# EAGLE design KEYDUINO nano (EAGLE 7.4.0)
5V: 2
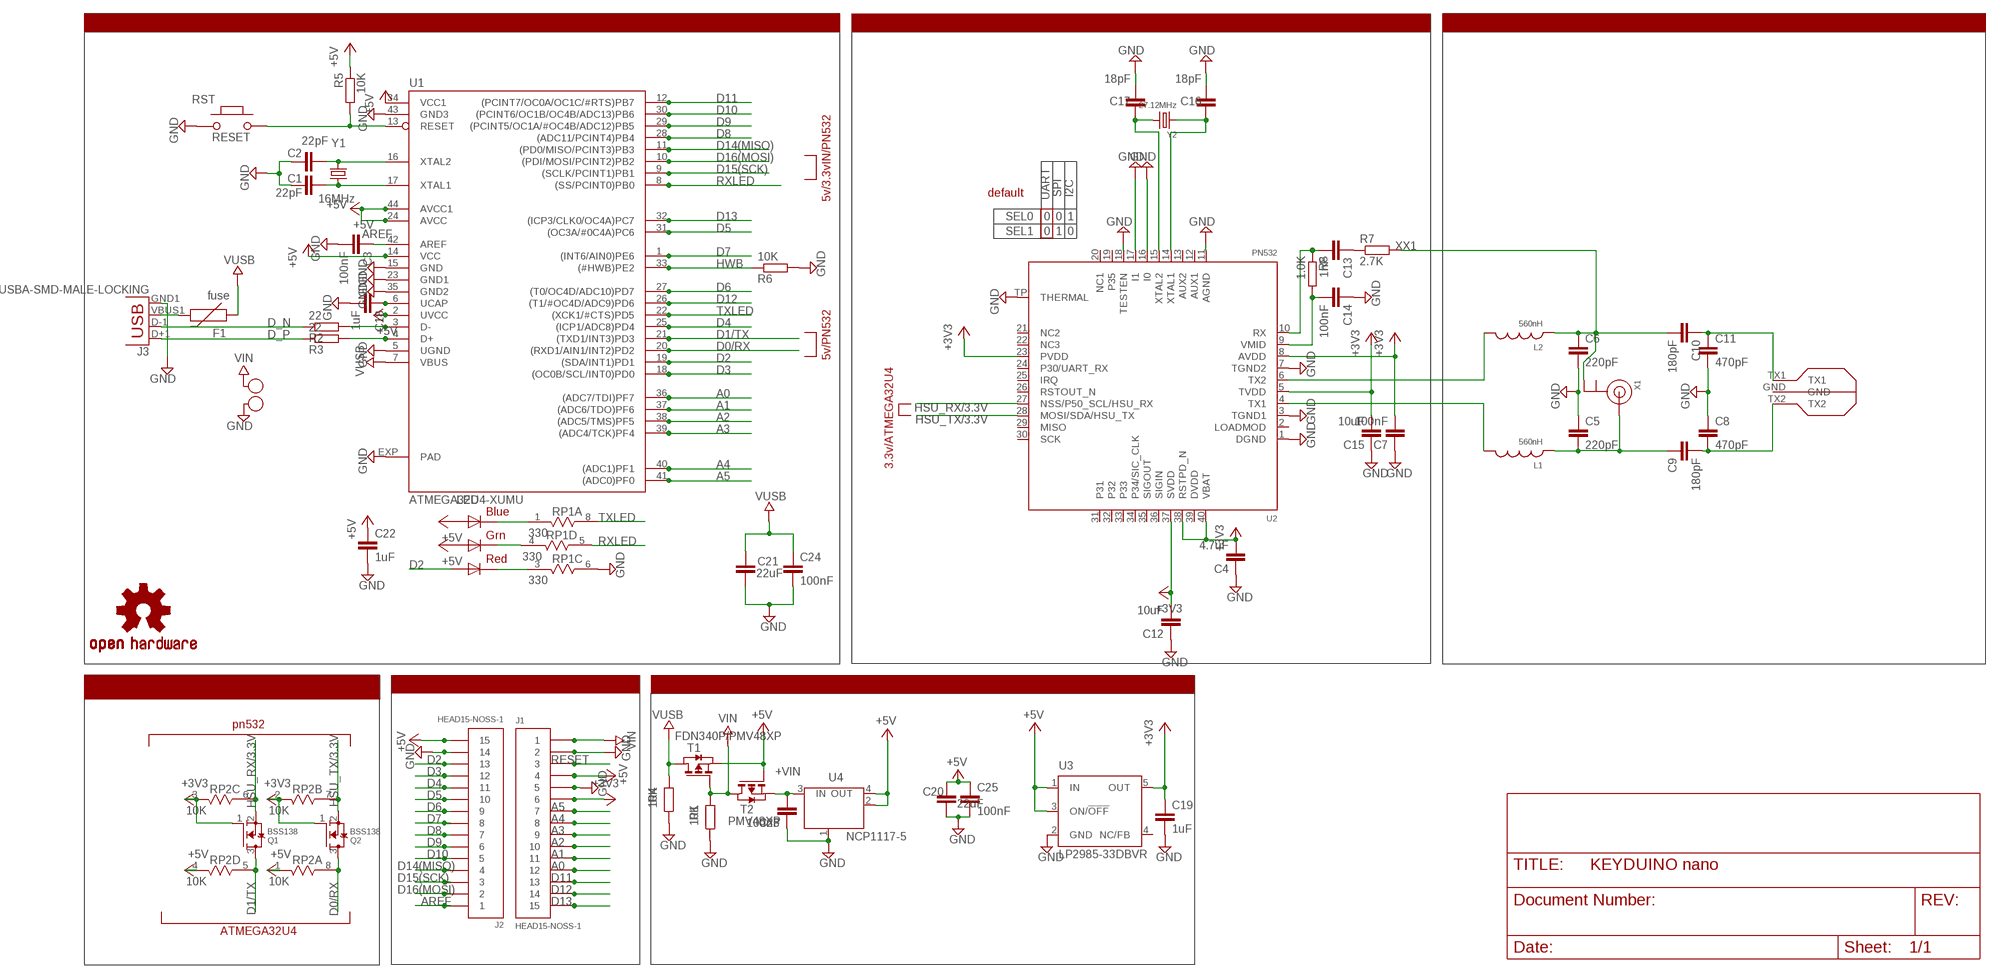
[diagram p0: schematic, sheet 1]

## Parts
C1  22pF  CAP0603-CAP  [0603-CAP]
C2  22pF  CAP0603-CAP  [0603-CAP]
C3  100nF  C-EUC0402  [C0402]
C4  4.7uF  C-EUC0603  [C0603]
C5  220pF  C-EUC0603  [C0603]
C6  220pF  C-EUC0603  [C0603]
C7  100nF  C-EUC0603  [C0603]
C8  470pF  C-EUC0603  [C0603]
C9  180pF  C-EUC0603  [C0603]
C10  180pF  C-EUC0603  [C0603]
C11  470pF  C-EUC0603  [C0603]
C12  10uF  C-EUC0805  [C0805]
C13  1nF  C-EUC0603  [C0603]
C14  100nF  C-EUC0603  [C0603]
C15  10uF  C-EUC0805  [C0805]
C16  18pF  C-EUC0402  [C0402]
C17  18pF  C-EUC0402  [C0402]
C18  1uF  C-EUC0603  [C0603]
C19  1uF  C-EUC0603  [C0603]
C20  22uF  C-EUC0805  [C0805]
C21  22uF  C-EUC0805  [C0805]
C22  1uF  C-EUC0603  [C0603]
C23  100nF  C-EUC0603  [C0603]
C24  100nF  C-EUC0603  [C0603]
C25  100nF  C-EUC0603  [C0603]
F1  fuse  PTC0603  [0603]
H1  SEW_HOLE-SMALL  [SIMPLE_HOLE_SM]
H2  SEW_HOLE-SMALL  [SIMPLE_HOLE_SM]
J1  HEAD15-NOSS-1  [HEAD15-NOSS-1]
J2  HEAD15-NOSS-1  [HEAD15-NOSS-1]
J3  USBA-SMD-MALE-LOCKING  [USB-A-SMT-MALE-LOCKING]
L1  560nH  INDUCTOR0805  [0805@1]
L2  560nH  INDUCTOR0805  [0805@1]
LED  RGBLED5050  [RGBLED5050]
LOGO1  OSHW-LOGOM  [OSHW-LOGO-M]
Q1  BSS138  MOSFET-NREFLOW  [SOT23]
Q2  BSS138  MOSFET-NREFLOW  [SOT23]
R1  10K  R-EU_R0603  [R0603]
R2  22  R-EU_R0603  [R0603]
R3  22  R-EU_R0603  [R0603]
R4  10K  R-EU_R0603  [R0603]
R5  10K  R-EU_R0603  [R0603]
R6  10K  R-EU_R0402  [R0402]
R7  2.7K  R-EU_R0603  [R0603]
R8  1.0K  R-EU_R0603  [R0603]
RP1  330  RES4NT  [RES4NT]
RP2  10K  RES4NT  [RES4NT]
RST  RESET  PB157  [157SW]
T1  FDN340P/PMV48XP  PMOSSOT23  [SOT-23]
T2  PMV48XP  PMOSSOT23  [SOT-23]
U1  ATMEGA32U4-XUMU  [QFN44ML7X7]
U2  PN532  [HVQFN40-6X6]
U3  LP2985-33DBVR  LP2985-XXDBVR33  [SOT23-DBV]
U4  NCP1117-5  LINEAR_MC33269ST  [LINEAR_SOT223]
U$1  KN1  [KEYDUINO_NANO_ANTENNA]
X1  ANTENNA_U.FL  [U.FL]
Y1  16MHz  CRYSTAL5X3  [CRYSTAL-SMD-5X3]
Y2  27.12MHz  CRYSTALTHIN  [CRYSTAL_3.2X2.5]

## Nets
+3V3 [+3v3]: C4.2 C7.2 C12.2 C15.2 C19.1 J1.6 Q1.1(G) Q2.1(G) RP2.2 RP2.3 U2.5(TVDD) U2.8(AVDD) U2.23(PVDD) U2.37(SVDD) U2.38(RSTPD_N) U2.40(VBAT) U3.5(OUT)
+5V [+5V]: C20.1 C22.1 C25.1 J1.4 J2.15 LED.1(GREEN_A) LED.3(BLUE_A) R5.1 RP2.1 RP2.4 T1.2(S) T2.3(G) U1.2(UVCC) U1.14(VCC) U1.24(AVCC) U1.34(VCC1) U1.44(AVCC1) U3.1(IN) U3.3(ON/!OFF) U4.2(OUT) U4.4(OUT)
+VIN [+5V]: C23.1 T2.2(S) U4.3(IN)
A0: J1.12 U1.36((ADC7/TDI)PF7)
A1: J1.11 U1.37((ADC6/TDO)PF6)
A2: J1.10 U1.38((ADC5/TMS)PF5)
A3: J1.9 U1.39((ADC4/TCK)PF4)
A4: J1.8 U1.40((ADC1)PF1)
A5: J1.7 U1.41((ADC0)PF0)
AREF: C3.1 J2.1 U1.42(AREF)
CON1 [RF]: C5.2 C9.1 L1.1 X1.3(SIGNAL)
D0/RX: Q2.3(D) RP2.8 U1.20((RXD1/AIN1/INT2)PD2)
D1/TX: Q1.3(D) RP2.5 U1.21((TXD1/INT3)PD3)
D2: J2.13 LED.2(RED_A) U1.19((SDA/INT1)PD1)
D3: J2.12 U1.18((OC0B/SCL/INT0)PD0)
D4: J2.11 U1.25((ICP1/ADC8)PD4)
D5: J2.10 U1.31((OC3A/#0C4A)PC6)
D6: J2.9 U1.27((T0/OC4D/ADC10)PD7)
D7: J2.8 U1.1((INT6/AIN0)PE6)
D8: J2.7 U1.28((ADC11/PCINT4)PB4)
D9: J2.6 U1.29((PCINT5/OC1A/#OC4B/ADC12)PB5)
D10: J2.5 U1.30((PCINT6/OC1B/OC4B/ADC13)PB6)
D11: J1.13 U1.12((PCINT7/OC0A/OC1C/#RTS)PB7)
D12: J1.14 U1.26((T1/#OC4D/ADC9)PD6)
D13: J1.15 U1.32((ICP3/CLK0/OC4A)PC7)
D14(MISO): J2.4 U1.11((PD0/MISO/PCINT3)PB3)
D15(SCK): J2.3 U1.9((SCLK/PCINT1)PB1)
D16(MOSI): J2.2 U1.10((PDI/MOSI/PCINT2)PB2)
D_N: R2.2 U1.3(D-)
D_P: R3.2 U1.4(D+)
GND [power]: C1.2 C2.2 C3.2 C4.1 C5.1 C6.2 C7.1 C8.1 C11.2 C12.1 C14.1 C15.1 C16.1 C17.1 C18.2 C19.2 C20.2 C21.2 C22.2 C23.2 C24.2 C25.2 H2.P$1 J1.2 J1.5 J2.14 J3.GND1(GND) R1.1 R4.1 R6.2 RP1.6 RST.1 U1.5(UGND) U1.15(GND) U1.23(GND1) U1.35(GND2) U1.43(GND3) U1.EXP(PAD) U2.1(DGND) U2.3(TGND1) U2.7(TGND2) U2.11(AGND) U2.16(I0) U2.17(I1) U2.18(TESTEN) U2.TP(THERMAL) U3.2(GND) U4.1(GND/ADJ)
HSU_RX/3.3V: Q1.2(S) RP2.6 U2.27(NSS/P50_SCL/HSU_RX)
HSU_TX/3.3V: Q2.2(S) RP2.7 U2.28(MOSI/SDA/HSU_TX)
HWB: R6.1 U1.33((#HWB)PE2)
N$1: J3.D-1(D-) R2.1
N$2: C1.1 U1.17(XTAL1) Y1.1
N$4: LED.5(RED_C) RP1.3
N$5: C2.1 U1.16(XTAL2) Y1.3
N$7: J3.D+1(D+) R3.1
N$8: C13.1 R7.1
N$9: L1.2 U2.4(TX1)
N$10: L2.2 U2.6(TX2)
N$11: F1.2 J3.VBUS1(VBUS)
N$12: LED.6(GREEN_C) RP1.4
N$13: LED.4(BLUE_C) RP1.1
N$47: C16.2 U2.14(XTAL1) Y2.1
N$48: C17.2 U2.15(XTAL2) Y2.2
N$49: C14.2 R8.2 U2.9(VMID)
N$50: C13.2 R8.1 U2.10(RX)
RESET: J1.3 R5.2 RST.2 U1.13(RESET)
RXLED: RP1.5 U1.8((SS/PCINT0)PB0)
TX1_ANTENNA [RF]: C8.2 C9.2 U$1.TX2
TX2_ANTENNA [RF]: C10.1 C11.1 U$1.TX1
TXLED: RP1.8 U1.22((XCK1/#CTS)PD5)
UCAP: C18.1 U1.6(UCAP)
VIN [+5V]: H1.P$1 J1.1 R1.2 T1.3(G) T2.1(D)
VUSB [+5V]: C21.1 C24.1 F1.1 R4.2 T1.1(D) U1.7(VBUS)
XX1 [RF]: C6.1 C10.2 L2.1 R7.2 X1.2(GND)
Unconnected: RP1.2 RP1.7 U2.2(LOADMOD) U2.12(AUX1) U2.13(AUX2) U2.19(P35) U2.20(NC1) U2.21(NC2) U2.22(NC3) U2.24(P30/UART_RX) U2.25(IRQ) U2.26(RSTOUT_N) U2.29(MISO) U2.30(SCK) U2.31 U2.32 U2.33 U2.34(P34/SIC_CLK) U2.35(SIGOUT) U2.36(SIGIN) U2.39(DVDD) U3.4(NC/FB) U$1.GND U$1.P$4(NT1) U$1.P$5(NT2) X1.1(GND)

## Notes on the sheet
- ATMEGA32U4 | PN532 | ACCORDING CIRCUIT
- 5v/3.3vIN/PN532
- default | UART | SPI | I2C
- SEL0 | 0 | 0 | 1
- SEL1 | 0 | 1 | 0
- 5v/PN532
- 3.3v/ATMEGA32U4
- PINOUT | SUPPLY
- level converter
- pn532
- ATMEGA32U4

## Library data of the parts
C1 C2 = SparkFun:CAP: Capacitor Standard 0603 ceramic capacitor, and 0.1" leaded capacitor.
C3 C5 C6 C8-C15 C19-C21 C23 C25 = rcl:C-EU: CAPACITOR, European symbol
C4 C7 C16-C18 C22 C24 = resistor:C-EU: CAPACITOR, European symbol
F1 = SparkFun-PowerIC:PTC: Resettable Fuse PTC Resettable Fuse. Spark Fun Electronics SKU : COM-08357
H1 H2 = LilyPad-Wearables:SEW_HOLE-SMALL: .070" hole with 20mil annular ring
J1 J2 = MyCON2:HEAD15-NOSS-1
J3 = SparkFun-Connectors:USB: USB Connectors USB-B-PTH is fully proven SKU : PRT-00139/CONN-08278 USB-miniB is fully proven SKU : PRT-00587 USB-A-PCB is untested. USB-A-H is throughly reviewed, but untested. Spark Fun Electronics SKU : PRT-00437 USB-B-SMT is throughly reviewed, but untested. Needs silkscreen touching up. USB-A-S has not been used/tested USB-MB-H has not been used/tested USB-MICROB has been used. CONN-09505
L1 L2 = microbuilder:INDUCTOR: Inductors 0603: 10nH Ceramic Inductor - microwire antenna/RF (Digikey: 712-1434-2-ND) 0805: 560nH Ceramic Inductor - RF (Digikey: 553-1047-1-ND) 1007 (2518 Metric) SMT: 10µH 10% 250mOhm 820mA 1007 Inductor (Digikey: 587-2189-1-ND) 22µH 10% 500mOhm 580mA 1007 Inductor (Digikey: 587-2190-1-ND) 47µH 10% 950mOhm 420mA 1007 Inductor (Digikey: 587-2191-1-ND) 47µH 5% 100mOhm 1A 1008 Inductor (Digikey: 732-1816-1-ND)
LED = adafruit:RGBLED: For 5050 RGB LEDs, the order of the LEDs may vary from one manufacturer to another!
LOGO1 = SparkFun-Aesthetics:OSHW-LOGO: Open Source Hardware Logo This logo indicates the piece of hardware it is found on incorporates a OSHW license and/or adheres to the definition of open source hardware found here: http://freedomdefined.org/OSHW
Q1 Q2 = adafruit:MOSFET-N: N-Channel Mosfet 2N7002E - 60V 260mA SOT23 [Digikey: 2N7002ET1GOSTR-ND] - REEL BSH103 - 30V 850mA SOT23 [Digikey: 568-5013-1-ND]
R1 R4 = resistor:R-EU_: RESISTOR, European symbol
R2 R3 R5-R8 = rcl:R-EU_: RESISTOR, European symbol
RP1 RP2 = MySMD:RES4NT
RST = MySMD:PB157
T1 T2 = zetex:PMOSSOT23: MOS FET
U1 = SmartPrj:ATMEGA32U4-XU
U2 = microbuilder:PN532: PN532 - Near Field Communication (NFC) controller Highly integrated transceiver module for contactless communication at 13.56 MHz (14443A/MIFARE, FeliCa, I4443B)
U3 = SmartPrj:LP2985-XXDBVR: ULTRALOW-POWER 50-mA LOW-DROPOUT LINEAR REGULATORS 50-mA Low-Dropout Regulator Source: http://focus.ti.com/lit/ds/symlink/tps77001.pdf
U4 = SmartPrj:LINEAR_MC33269ST*: Adjustable Output Low Dropout Voltage Regulator 800 mA Source: http://www.onsemi.com/pub/Collateral/MC33269-D.PDF
U$1 = KeyDuino:KN1
X1 = adafruit:ANTENNA_U.FL: U.FL Antenna Connector
Y1 = SparkFun:CRYSTAL: Crystals
Y2 = microbuilder:CRYSTAL: Crystals

## Net classes
0 default: width 0.102 mm
1 power: width 0.152 mm, clearance 0.15 mm
2 +5V: clearance 0.15 mm
3 +3v3: clearance 0.15 mm
5 RF: clearance 0.3 mm

## Board
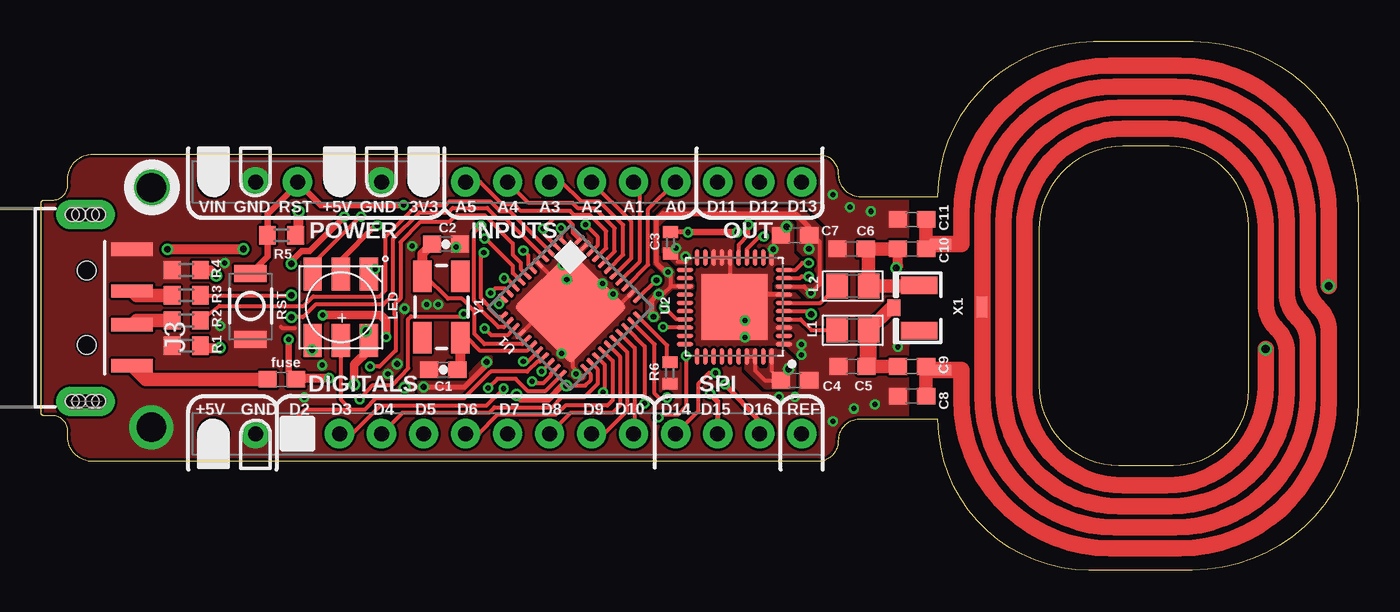
[diagram p1: board, top side]
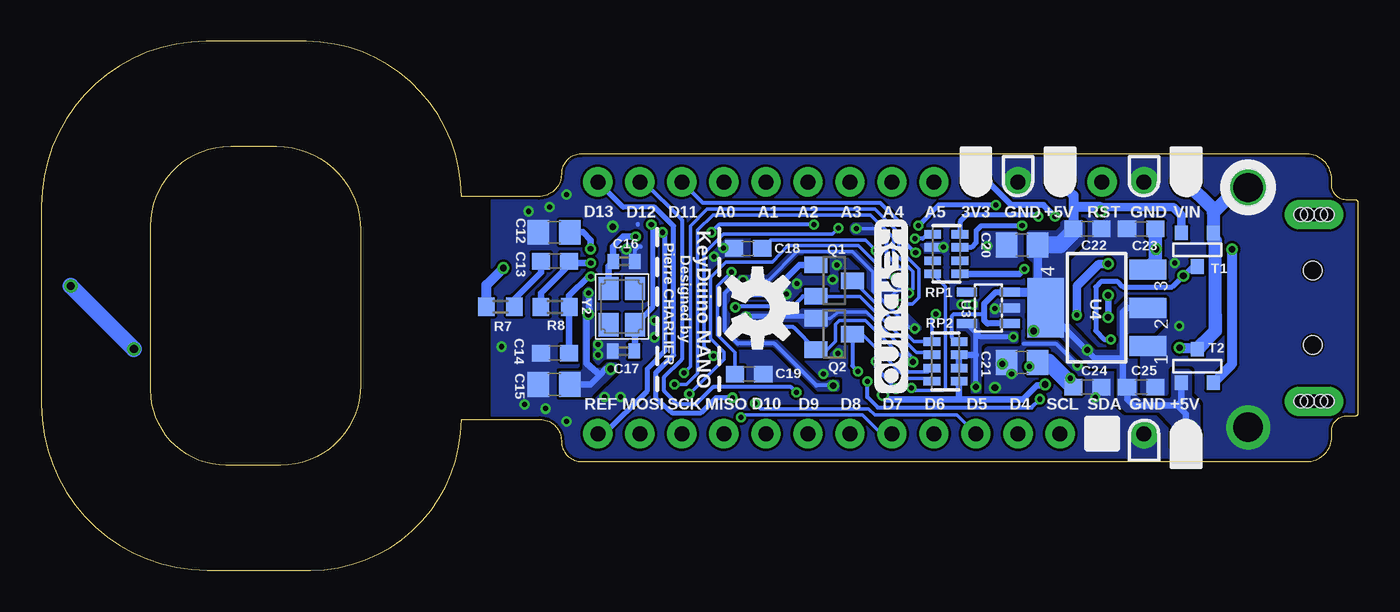
[diagram p2: board, bottom side, seen from below]

Size 79.64 x 32 mm. Coordinates in mm from the lower left corner, seen from the top.
Outline: 0,22.25 arc-90 0.15,22.4 0.68,22.4 arc90 1.6,23.32 1.6,23.65 arc-90 3.12,25.18 46.98,25.18 arc-90 48.19,23.98 arc90 49.56,22.6 54.24,22.6 arc-90 63.64,32 69.66,32 arc-90 79.64,22.02 79.64,10.02 arc-90 69.61,0 63.36,0 arc-90 54.24,9.12 49.48,9.12 arc90 48.19,7.82 arc-90 46.94,6.57 3.1,6.57 arc-90 1.6,8.07 1.6,8.42 arc90 0.68,9.35 0.12,9.35 arc-90 0,9.48 0,22.25
Outline: 60.33,11.17 arc90 65.15,6.35 68.45,6.35 arc90 73.03,10.92 73.03,20.83 arc90 68.2,25.65 65.41,25.65 arc90 60.33,20.57 60.33,11.17
Copper layers (1*16): Top 0.035mm / dielectric 1.6mm / Bottom 0.035mm
Design rules "Elecrow_2-layer_PCB_eagle_rule *": minimum track width 4mil, minimum drill 12mil, track to track 6mil, track to pad 6mil, pad to pad 6mil, via to via 8mil, smd to smd 0mil, copper to edge 1mil, drill to drill 10mil, minimum pad ring 6mil, minimum via ring 6mil, stop-mask expansion 0mil, vias tented up to drill 100mil, thermal gap 10mil
tRestrict: area 52.6,-0.9 to 80.6,33.1
bRestrict: area 52.6,-0.9 to 80.6,33.1

### Footprints (pad centres in the part's own frame; a part is rotated, then mirrored left to right if it is on the bottom)
0603-CAP = smd 1.1 x 1: 1 -0.85,0; 2 0.85,0
C0402 = smd 0.7 x 0.9: 1 -0.65,0; 2 0.65,0
C0603 = smd 1.1 x 1: 1 -0.85,0; 2 0.85,0
C0805 = smd 1.3 x 1.5: 1 -0.95,0; 2 0.95,0
0603 = smd 1.1 x 1: 1 -0.85,0; 2 0.85,0
SIMPLE_HOLE_SM = drill 1.778 pad 2.286: P$1 0,0
HEAD15-NOSS-1 = drill 0.914 pad 1.778: 1 0,0; 2 2.54,0; 3 5.08,0; 4 7.62,0; 5 10.16,0; 6 12.7,0; 7 15.24,0; 8 17.78,0; 9 20.32,0; 10 22.86,0; 11 25.4,0; 12 27.94,0; 13 30.48,0; 14 33.02,0; 15 35.56,0
USB-A-SMT-MALE-LOCKING = smd 0.8 x 2.5: D+1 1.027,-5.87; D-1 -1.027,-5.87; GND1 3.551,-5.87; VBUS1 -3.5,-5.87 | drill 0.8 pad 1.778 long: P$1 5.647,-3.05; P$3 -5.647,-3.05 | hole 1.1: 2.25,-3.12; -2.25,-3.12 | hole 0.8: -5.647,-3.45; -5.647,-3.85; -5.647,-2.65; -5.647,-2.25; 5.647,-3.45; 5.647,-3.85; 5.647,-2.65; 5.647,-2.25
0805@1 = smd 1.3 x 1.5: 1 -0.95,0; 2 0.95,0
RGBLED5050 = smd 2 x 1.1: 1 -2,1.7; 2 -2,0; 3 -2,-1.7; 4 2,-1.7; 5 2,0; 6 2,1.7
SOT23 = smd 1 x 1.4: 1 -0.95,-1.1; 2 0.95,-1.1; 3 0,1.1
R0603 = smd 1 x 1.1: 1 -0.85,0; 2 0.85,0
R0402 = smd 0.7 x 0.9: 1 -0.65,0; 2 0.65,0
RES4NT = smd 0.508 x 1.016: 1 0,0; 2 0.8,0; 3 1.6,0; 4 2.4,0; 5 2.4,1.651; 6 1.6,1.651; 7 0.8,1.651; 8 0,1.651
157SW = smd 1.016 x 1.981: 1 0,0; 2 4,0
SOT-23 = smd 0.787 x 0.889: 1 0.025,-1.016; 2 -0.94,1.016; 3 0.991,1.016
QFN44ML7X7 = smd 0.75 x 0.275: 1 -3.275,2.5; 2 -3.275,2; 3 -3.275,1.5; 4 -3.275,1; 5 -3.275,0.5; 6 -3.275,0; 7 -3.275,-0.5; 8 -3.275,-1; 9 -3.275,-1.5; 10 -3.275,-2; 11 -3.275,-2.5; 23 3.275,-2.5; 24 3.275,-2; 25 3.275,-1.5; 26 3.275,-1; 27 3.275,-0.5; 28 3.275,0; 29 3.275,0.5; 30 3.275,1; 31 3.275,1.5; 32 3.275,2; 33 3.275,2.5 | smd 0.275 x 0.75: 12 -2.5,-3.275; 13 -2,-3.275; 14 -1.5,-3.275; 15 -1,-3.275; 16 -0.5,-3.275; 17 0,-3.275; 18 0.5,-3.275; 19 1,-3.275; 20 1.5,-3.275; 21 2,-3.275; 22 2.5,-3.275; 34 2.5,3.275; 35 2,3.275; 36 1.5,3.275; 37 1,3.275; 38 0.5,3.275; 39 0,3.275; 40 -0.5,3.275; 41 -1,3.275; 42 -1.5,3.275; 43 -2,3.275; 44 -2.5,3.275 | smd 4.826 x 4.826: EXP 0,0
HVQFN40-6X6 = smd 1 x 0.25: 1 -2.99,2.25; 2 -2.99,1.75; 3 -2.99,1.25; 4 -2.99,0.75; 5 -2.99,0.25; 6 -2.99,-0.25; 7 -2.99,-0.75; 8 -2.99,-1.25; 9 -2.99,-1.75; 10 -2.99,-2.25; 21 2.99,-2.25; 22 2.99,-1.75; 23 2.99,-1.25; 24 2.99,-0.75; 25 2.99,-0.25; 26 2.99,0.25; 27 2.99,0.75; 28 2.99,1.25; 29 2.99,1.75; 30 2.99,2.25 | smd 0.25 x 1: 11 -2.25,-2.99; 12 -1.75,-2.99; 13 -1.25,-2.99; 14 -0.75,-2.99; 15 -0.25,-2.99; 16 0.25,-2.99; 17 0.75,-2.99; 18 1.25,-2.99; 19 1.75,-2.99; 20 2.25,-2.99; 31 2.25,2.99; 32 1.75,2.99; 33 1.25,2.99; 34 0.75,2.99; 35 0.25,2.99; 36 -0.25,2.99; 37 -0.75,2.99; 38 -1.25,2.99; 39 -1.75,2.99; 40 -2.25,2.99 | smd 4 x 4: TP 0,0
SOT23-DBV = smd 0.55 x 1.2: 1 -0.95,-1.3; 2 0,-1.3; 3 0.95,-1.3; 4 0.95,1.3; 5 -0.95,1.3
LINEAR_SOT223 = smd 1.219 x 2.235: 1 -2.311,-3.099; 2 0,-3.099; 3 2.311,-3.099 | smd 3.6 x 2.2: 4 0,3.099
KEYDUINO_NANO_ANTENNA = smd 1.27 x 0.635: GND 0,1.27 | drill 0.5: P$4 -1.27,22.225; P$5 2.54,18.415 | smd 0.635 x 1.27: TX1 -3.81,-1.27; TX2 3.81,-1.27
U.FL = smd 2.2 x 1.05: 1 0,1.375; 2 0,-1.375 | smd 0.8 x 1: 3 1.525,0
CRYSTAL-SMD-5X3 = smd 1.9 x 1.1: 1 -1.85,-1.15; 2 1.85,-1.15; 3 1.85,1.15; 4 -1.85,1.15
CRYSTAL_3.2X2.5 = smd 1.4 x 1.2: 1 -1.1,-0.8; 2 1.1,0.8; GND1 -1.1,0.8; GND2 1.1,-0.8

### Placement (x,y rotation side)
C1  24.31,12.14 180 top
C2  24.47,19.73 0 top
C3  38.05,19.81 270 top
C4  45.58,11.49 180 top
C5  49.05,12.33 0 top
C6  49,19.44 180 top
C7  45.58,20.25 0 top
C8  52.65,10.54 0 top
C9  52.66,12.33 0 top
C10  52.66,19.44 180 top
C11  52.65,21.23 180 top
C12  48.62,20.45 0 bottom
C13  48.57,18.71 0 bottom
C14  48.57,13.14 0 bottom
C15  48.62,11.24 0 bottom
C16  44.4,18.68 180 bottom
C17  44.43,13.26 0 bottom
C18  36.89,19.48 180 bottom
C19  36.83,11.87 0 bottom
C20  20.32,19.68 180 bottom
C21  20.32,12.57 180 bottom
C22  16.37,20.65 0 bottom
C23  13.12,20.65 180 bottom
C24  16.37,11.09 0 bottom
C25  13.12,11.09 0 bottom
F1  14.54,11.55 180 top
H1  6.65,23.15 0 top
H2  6.65,8.65 0 top
J1  10.42,23.49 0 top
J2  45.98,8.25 180 top
J3  -0.38,15.87 90 top
L1  49.07,14.53 180 top
L2  49.07,17.19 180 top
LED  18.11,15.91 90 top
LOGO1  36.32,15.87 270 bottom
Q1  31.69,17.52 270 bottom
Q2  31.69,14.29 270 bottom
R1  8.76,13.59 0 top
R2  8.76,15.11 0 top
R3  8.76,16.63 0 top
R4  8.76,18.16 0 top
R5  14.53,20.27 180 top
R6  38.01,11.92 270 top
R7  51.87,15.94 180 bottom
R8  48.57,15.92 0 bottom
RP1  24.08,17.93 90 bottom
RP2  24.13,11.43 90 bottom
RST  12.65,13.96 90 top
T1  9.75,19.39 0 bottom
T2  9.7,12.36 180 bottom
U1  32.01,15.91 315 top
U2  41.91,15.92 180 top
U3  22.35,15.87 90 bottom
U4  15.81,15.87 90 bottom
U$1  55.63,15.92 270 top
X1  53.09,15.87 180 top
Y1  24.19,15.92 90 top
Y2  44.53,15.95 270 bottom

### Tracks (layer width: path | path; a pad name or v marks a point on that pad's centre or on a via)
+3V3  (via drill 0.3, 0.3 pad 0.41, 0.35, 0.35 pad 0.41, 0.36, 0.4, 0.4 pad 0.41)
  Top 0.254: U2.8 46.14,17.17 v46.55,16.76 47.07,17.28 47.07,19.87 46.74,20.2 C7.2 | U2.37 U2.38 43.16,12.08 43.75,11.49 C4.2 | 38.04,17.17 38.04,17.9 v37.91,18.03 | 38.04,17.17 38.04,17.14 37.59,16.7 v37.34,16.7 | U2.23 38.04,17.17 | U2.40 44.16,12.06 | U2.5 46.43,15.67 v46.56,15.49
  Top 0.3: v37.91,18.03 37.78,18.03 37.19,18.63 37.19,21.18 37.59,21.59 45.59,21.59 46.43,20.75 C7.2 v46.42,19.44 | v37.34,16.7 37.28,16.7 36.9,16.32 36.9,15.55 37.11,15.34 v37.02,15.34
  Top 0.305: v23.12,11.09 25.6,11.09 26.94,12.42 v26.94,12.61
  Top 0.406: v18.33,21.4 16.23,19.3 15.75,19.3 15.11,18.67 v15.11,18.54
  Top 0.5: v20.84,14.12 20.84,15.11 20.52,15.43 v17.02,15.43
  Bottom 0.2: v37.91,18.03 38.74,17.21 38.74,14.22 37.68,13.17 C19.1 | 32.89,15.34 Q2.1 31.94,15.23 31.43,15.62 29.73,15.62 26.94,12.82 v26.94,12.61
  Bottom 0.254: U3.5
  Bottom 0.3: 32.89,15.34 v37.02,15.34 | 46.5,15.56 v46.56,15.49
  Bottom 0.305: v23.12,11.09 23.12,13.03 23.12,14.38 | v20.84,14.12 22.85,14.12 23.12,14.38 | U3.5 23.12,14.38
  Bottom 0.35: J1.6 22.37,23.49 20.97,22.1 19.03,22.1 v18.33,21.4
  Bottom 0.406: RP2.2 RP2.3 23.12,13.03 | Q1.1 33.79,18.47 35.56,16.7 v37.34,16.7 | v45.19,12.18 45.51,12.18 45.85,11.81 | 45.85,11.81 46.67,12.51 46.67,15.43 v46.56,15.49 | v46.55,16.76 46.5,15.56 | 45.85,11.81 46.42,11.24 C15.2 | v46.42,19.44 46.42,19.99 46.88,20.45 C12.2
  Bottom 0.5: v17.02,15.43 17.02,17.21 15.69,18.54 v15.11,18.54
  pour Top (no thermals): 42.61,12.19 42.61,13.33 43.18,13.33 43.18,12.38 43.44,12.13 43.88,12.13 44.07,12.32 44.07,13.33 44.83,13.33 45.53,12.63 45.53,11.05 43.75,11.05
  pour Top (no thermals): 46.61,17.21 44.45,17.21 44.45,17.08 45.78,17.08 46.36,16.51 46.93,16.51 47.18,16.76 47.18,20.64 45.98,21.84 37.66,21.84 37.09,21.27 37.09,18.54 37.78,17.84 37.78,17.46 36.64,16.32 36.64,15.37 36.89,15.11 37.28,15.11 37.34,15.17 37.34,15.49 37.15,15.68 37.15,16.06 38.16,17.08 39.37,17.08 39.37,17.27 38.23,17.27 38.23,18.1 37.28,19.05 37.28,20.83 37.97,21.52 45.34,21.52 45.78,21.08 45.78,19.37 46.17,18.98 46.67,18.98 46.8,18.86 46.8,17.4
  pour Bottom (no thermals): 48.2,10.6 46.42,10.6 44.9,12.13 44.9,12.44 45.4,12.44 45.72,12.13 46.17,12.13 46.61,12.57 46.61,13.97 46.29,14.29 46.29,16.83 46.48,17.02 46.74,17.02 46.8,16.95 46.8,12.13 46.99,11.94 48.2,11.94
  pour Bottom (no thermals): 35.37,15.05 37.15,15.11 37.28,15.24 37.28,15.43 37.15,15.56 33.78,15.56 33.59,15.75 29.78,15.75 26.73,12.7 26.73,12.51 26.86,12.38 27.05,12.38 27.18,12.51 27.18,12.95 29.66,15.43 31.56,15.43 32.26,14.73 33.47,14.73 33.85,15.11
  pour Top (no thermals): 22.86,11.36 25.4,11.36 26.93,12.89 27.18,12.89 27.18,12.51 25.53,10.79 22.86,10.79
  pour Bottom (no thermals): 23.33,10.79 22.86,10.79 22.86,13.59 22.61,13.84 20.65,13.84 20.65,14.35 22.73,14.35 22.99,14.6 22.99,15.11 24.26,15.11 24.26,14.6 23.72,14.6 23.32,14.2
+5V  (via drill 0.3, 0.34, 0.35, 0.4)
  Top 0.254: v37.2,17.54 37.14,17.51 U1.34 | U1.14 28.32,14.35 28.18,14.21 27.22,14.21 v26.8,14.63 | U1.2 30.35,20.39 v30.35,20.66 31,21.31 31.73,21.31 32.13,20.9 32.13,20.42 U1.44 | U1.24 33.2,11.89 33.2,11.48 32.89,11.17 v31.75,11.17 | 19.94,14.54 v19.62,14.48
  Top 0.305: 20.07,13.91 LED.3 | v16.38,13.33 16.38,13.81 LED.1
  Top 0.406: v31.75,11.17 31.5,11.17 30.67,10.35 29,10.35 v28.74,10.6
  Top 0.5: v18.92,11.24 18.92,12.44 19.81,13.33 LED.3 19.62,14.1 v19.62,14.48
  Top 0.61: v15.56,21.71 15.56,20.45 R5.1
  Bottom 0.2: v30.35,20.66 29.27,20.66 28.53,19.91 28.53,19.09 27.36,17.92 27.36,17.42 28.63,16.2 | v37.2,17.54 35.68,17.54 33.94,19.28 30.58,19.28 29.34,18.03 29.34,16.9 28.63,16.2 | 19.37,15.4 19.37,15.23 | v26.8,14.63 27.07,14.63 28.63,16.2
  Bottom 0.254: 24.37,13.83 24.56,14.08 24.56,15.39 24.46,15.49 22.61,15.49 | v37.2,17.54 37.52,17.54 38.29,16.76 38.29,14.48 37.53,13.71 35.31,13.71 32.77,11.17 v31.75,11.17 | 24.13,10.35 24.26,10.32
  Bottom 0.305: 24.12,13.83 RP2.4 24.37,13.83 | 24.08,11.43 RP2.1 | v16.38,13.33 16.64,13.54
  Bottom 0.35: U3.1 22.42,14.92 22.61,15.11 22.61,15.49 22.61,16.13 21.91,16.82 U3.3
  Bottom 0.406: U4.2 13.98,15.87 14.24,15.62 14.24,12.82 | 17.22,20.5 C22.1 | U4.4 18.51,15.4 16.64,13.54 15.93,12.82 14.24,12.82 | 10.92,9.97 13.59,9.97 13.97,10.35 C25.1 14.24,11.33 14.24,12.82 | 10.92,9.97 10.69,10.2 T2.3 | J2.15 10.42,9.46 10.92,9.97 | RP2.1 24.13,10.35 | v28.74,10.6 28.46,10.32 24.26,10.32 20.28,10.32 19.43,11.17 18.99,11.17 v18.92,11.24 | 19.37,16.31 19.32,16.26
  Bottom 0.5: 15.56,21.97 11.18,21.97 10.69,21.49 T1.2 | C20.1 19.37,16.31
  Bottom 0.55: U3.3 19.93,16.82 19.32,16.26 U4.4
  Bottom 0.61: J1.4 17.22,22.68 17.22,21.97 | 17.22,21.97 C22.1 | 17.22,21.97 15.56,21.97 v15.56,21.71
  Bottom 1: U4.4 18.82,15.97
  Bottom 1.016: 17.22,20.5 18.04,19.68 C20.1
  Bottom 1.27: 19.37,15.4 18.51,15.4
  pour Bottom (isolate 0.1, no thermals): 9.78,7.62 9.78,9.9 10.29,10.41 10.29,11.94 11.05,11.94 11.05,10.41 11.3,10.16 13.34,10.16 13.59,10.41 13.59,13.46 11.81,15.24 11.81,16.25 13.84,16.25 14.35,15.75 14.35,13.08 16,13.08 17.78,14.86 17.78,19.05 16.77,20.06 16.77,20.95 17.78,20.95 17.78,20.7 18.16,20.32 19.81,20.32 19.81,19.05 19.43,18.67 19.43,14.35 17.91,14.35 16,12.44 14.35,12.44 14.35,10.16 13.97,9.78 11.94,9.78 11.05,8.89 11.05,7.62
  pour Bottom (no thermals): 32.77,11.43 31.5,11.43 31.5,10.92 32.64,10.92 35.31,13.59 37.47,13.59 38.36,14.48 38.36,16.76 37.34,17.78 35.69,17.78 34.04,19.43 30.48,19.43 28.2,17.14 27.81,17.14 27.43,17.52 27.43,17.78 28.54,18.95 28.56,19.73 29.21,20.38 30.48,20.38 30.61,20.51 30.61,20.83 30.48,20.95 29.34,20.95 28.45,20.06 28.45,19.3 27.18,18.03 27.18,17.46 28.26,16.38 28.26,16.06 27.75,15.56 27.37,15.56 26.48,14.67 26.8,14.35 29.59,17.08 29.59,18.16 30.61,19.18 33.91,19.18 35.82,17.27 37.47,17.27 38.1,16.63 38.1,14.48 37.47,13.84 35.18,13.84
+VIN  (via drill 0.4)
  Top 0.61: v7.62,19.42 v7.63,19.43 v12.22,19.43
  Bottom 0.2: v12.22,19.43 12.27,19.38 12.27,18.87
  Bottom 0.406: U4.3 12.8,18.16
  Bottom 0.61: T2.2 7.62,12.48 v7.62,19.42 | 12.7,18.26 U4.3
  Bottom 0.813: 12.7,18.26 12.27,18.69 12.27,18.87 C23.1
A0
  Top 0.254: U1.36 36.7,18.49 36.7,21.84 J1.12
A1
  Top 0.254: U1.37 36.2,18.69 36.2,23.11 J1.11
A2
  Top 0.254: U1.38 35.69,18.89 35.69,21.08 J1.10
A3
  Top 0.254: U1.39 35.18,19.09 35.18,20.89 33.77,22.3 32.67,22.3 31.47,23.49 J1.9
A4
  Top 0.254: U1.40 34.67,19.29 34.67,20.7 33.48,21.89 32.46,21.89 32.13,22.22 29.47,22.22 J1.8
A5
  Top 0.25: 26.54,23.49 J1.7
  Top 0.254: U1.41 34.16,19.48 34.16,20.51 33.17,21.49 32.22,21.49 31.98,21.74 29,21.74 28.58,22.16 27.87,22.16 26.54,23.49
AREF  (via drill 0.3)
  Top 0.254: U1.42 33.66,19.68 33.66,20.15 v32.91,20.9
  Top 0.305: v39.12,20.45 38.98,20.46 C3.1
  Top 0.406: v39.12,20.45 v42.06,20.45
  Bottom 0.254: v32.91,20.9 38.66,20.9 v39.12,20.45
  Bottom 0.3: 45.59,8.25 42.99,10.86
  Bottom 0.305: J2.1 45.59,8.25 | 42.99,10.86 42.99,12.19 41.91,13.27 41.91,20.32 v42.06,20.45
CON1
  Top 0.813: C9.1 C5.2 | L1.1 51.37,15.87 X1.3
  Top 1.016: C5.2 50.02,12.46 L1.1
D0/RX  (via drill 0.3)
  Top 0.254: U1.20 v30.24,12.02
  Bottom 0.2: 30.29,14.29 Q2.3 30.01,14.29 27.32,11.59 25.95,11.59 RP2.8
  Bottom 0.254: Q2.3 30.59,12.36 v30.24,12.02
D1/TX  (via drill 0.3)
  Top 0.254: v19.24,10.35 20,11.17 21.21,11.17 22.19,12.21 22.19,15.2 22.35,15.37 25.41,15.37 v25.54,15.49 | U1.21 30.83,11.9 30.83,11.78 30.37,11.33 29.77,11.33 v29.68,11.42
  Bottom 0.2: Q1.3 30.56,17.52 26.86,13.83 RP2.5 25.78,15.25 v25.54,15.49
  Bottom 0.254: v19.24,10.35 19.75,9.84 29.05,9.84 29.68,10.48 v29.68,11.42
D2
  Top 0.254: J2.13 15.5,9.27 15.95,9.72 18.73,9.72 | LED.2 18.11,10.34 18.73,9.72 | 18.73,9.72 19.57,9.72 20.26,10.41 25.58,10.41 27.18,12.01 29.39,12.01 30,12.62 30.13,12.62 U1.19
D3  (via drill 0.3)
  Top 0.254: v27.94,10.98 26.93,9.97 20.51,9.97 18.8,8.25 J2.12 | v29.15,12.62 29.42,12.62 U1.18
  Bottom 0.254: v27.94,10.98 29.15,12.25 v29.15,12.62
D4
  Top 0.254: J2.11 21.84,9.52 27.08,9.52 27.41,9.85 30.88,9.85 31.5,10.48 32.84,10.48 33.66,11.29 33.66,12.14 U1.25
D5  (via drill 0.3)
  Top 0.254: U1.31 36.49,13.55 v36.49,10.08
  Bottom 0.2: J2.10 24.26,9.4 29.24,9.4 29.61,9.76 36.15,9.76 v36.49,10.08
D6
  Top 0.254: U1.27 34.55,12.66 34.55,10.29 34.23,9.97 31.69,9.97 31.12,9.42 27.59,9.42 26.44,8.25 J2.9
D7  (via drill 0.3)
  Top 0.254: v38.99,12.95 38.99,9.9 38.52,9.43 37.5,9.43 v37.33,9.26 | v31.43,20.7 31.43,20.02 U1.1
  Bottom 0.2: v38.99,12.95 39.56,13.52 39.56,19.18 38.39,20.34 31.79,20.34 v31.43,20.7 | J2.8 28.83,8.25 29.97,9.4 37.19,9.4 v37.33,9.26
D8
  Top 0.254: U1.28 34.99,12.93 34.99,9.97 34.55,9.52 32.01,9.52 J2.7
D9
  Top 0.254: U1.29 35.31,13.32 35.43,13.19 35.43,9.65 34.04,8.25 J2.6
D10
  Top 0.254: U1.30 35.88,13.45 35.88,8.32 J2.5
D11  (via drill 0.3)
  Top 0.254: v26.76,19.23 26.58,19.07 26.58,16.47 27.05,16 27.05,15.87 27.56,15.36 U1.12
  Bottom 0.254: J1.13 39.62,22.22 28.89,22.22 27.38,20.71 27.38,19.8 26.86,19.28 v26.76,19.23
D12  (via drill 0.3)
  Top 0.254: U1.26 34.06,12.44 34.06,10.86 v33.96,10.76
  Bottom 0.254: J1.14 43.18,23.49 40.9,21.21 40.9,12.76 41.98,11.68 41.98,10.86 41.15,10.03 40.07,10.03 39.02,11.09 34.29,11.09 v33.96,10.76
D13  (via drill 0.3)
  Top 0.254: U1.32 37.09,13.66 37.09,10.69 37.34,10.44 v37.85,10.44
  Bottom 0.305: J1.15 44.45,21.97 42.55,21.97 41.4,20.83 41.4,13.01 42.48,11.94 42.48,10.41 41.47,9.52 39.75,9.52 38.84,10.44 v37.85,10.44
D14(MISO)  (via drill 0.3)
  Top 0.254: J2.4 39.75,9.65 39.75,11.3 40.39,11.94 v40.77,11.94 | U1.11 27.92,16.34 v27.67,16.1
  Bottom 0.2: v40.77,11.94 40.39,12.32 40.39,20.83 39.37,21.84 29.21,21.84 27.76,20.39 27.76,19.43 26.56,18.22 26.56,16.49 26.95,16.1 v27.67,16.1
D15(SCK)  (via drill 0.3)
  Top 0.254: 28.62,17.17 U1.9 28.13,17.66 v27.98,17.66
  Top 0.3: 40.9,10.22 J2.3
  Top 0.305: v40.45,10.67 40.9,10.22
  Bottom 0.2: v40.45,10.67 38.36,12.76 38.36,13.21 39.18,14.03 39.18,17.71 38.24,18.65 35.42,18.65 34.47,19.63 30.22,19.63 28.26,17.66 v27.98,17.66
D16(MOSI)  (via drill 0.3)
  Top 0.254: v27.17,16.77 27.46,17.07 28.02,17.07 U1.10
  Top 0.305: v41.34,11.24 43.44,9.02 J2.2
  Bottom 0.2: v41.34,11.24 40.62,11.24 39.94,11.91 39.94,20.57 39.03,21.49 29.49,21.49 28.12,20.12 28.12,19.26 26.93,18.07 26.93,17.02 v27.17,16.77 27.1,16.82
D_N
  Top 0.254: U1.3 28.32,21.71 27.74,21.71 27.13,22.32 24.68,22.32 24.45,22.1 22.73,22.1 20.8,20.17 20.8,16.93 20.45,16.57 16.45,16.57 15.88,16 10.76,16 R2.2
D_P  (via drill 0.4)
  Top 0.254: U1.4 28.06,21.27 27.6,21.27 26.96,21.92 24.88,21.92 24.61,21.65 22.87,21.65 21.25,20.03 21.25,16.63 20.68,16.06 16.57,16.06 15.83,15.31 v15.11,15.31 | R3.2 v15.11,16.63
  Bottom 0.406: v15.11,15.31 v15.11,16.63
GND  (via drill 0.3, 0.3 pad 0.41, 0.35, 0.4)
  Top 0.25: U1.5 32.01,16.62 U1.EXP | U1.15 30.59,15.91 U1.EXP | 34.83,15.91 34.48,15.91 U1.EXP
  Top 0.254: U2.18 U2.17 U2.16 41.66,15.92 U2.TP | U1.35 34.83,15.91 | 41.91,16.67 U2.TP | 41.91,14.67 U2.TP | 32.26,13.41 32.39,13.92 | 32.26,13.41 32.26,15.91 U1.EXP 32.01,18.74 U1.43 | 38.48,18.67 38.99,18.67 38.99,18.86 | 34.19,16.7 34.48,16.41 34.48,15.91 | 32.26,13.41 32.12,13.27 32.17,12.26 U1.23 | 22.29,19.57 v22.42,19.61 | 14.48,14.73 14.57,14.64 15.34,14.64
  Top 0.3: U2.7 41.91,16.67 | 32.01,18.74 31.79,18.74 v31.52,18.48
  Top 0.406: 31.37,15.87 32.01,15.87 U1.EXP
  Top 0.61: 25.47,19.61 v25.09,19.54
  Top 0.813: 41.91,14.67 42.22,14.67
  Bottom 0.254: 43.56,20.89 43.56,20.95 | 43.37,19.58 43.52,19.58 43.75,19.35 C16.1 | 20.22,13.71 18.29,13.71 v16.98,12.41
  Bottom 0.305: 25.64,19.62 RP1.6
  other vias: 42.55,14.09 21.97,11.05 45.98,13.02 24,16.08 38.95,18.98 31.46,13.12 21.51,12.48 33.94,17.33 45.09,20.79 42.55,15.11 45.98,13.65 20.96,11.87 31.78,17.59 34.57,16.7 32.35,11.87 38.38,19.49 44.26,19.42 44.6,10.48 15.9,10.45 51.79,13.52 45.57,10.48 23.31,16.08 21.97,15.82 11.08,18.58 10.82,14.77 47.88,22.73 48.9,21.97 50.17,21.71 47.88,9.02 49.15,9.78 50.42,10.03
  pour Top (isolate 0.15, rank 2, no thermals): -0.04,3.64 -0.04,26.84 75.1,26.84 75.1,3.64
  pour Bottom (isolate 0.15, rank 2, no thermals): -0.04,3.64 -0.04,26.84 75.1,26.84 75.1,3.64
HSU_RX/3.3V  (via drill 0.3)
  Top 0.254: U2.27 38.41,15.17 v37.67,15.91
  Bottom 0.2: Q1.2 30.12,16.57 26.71,13.17 25.92,13.17 RP2.6
  Bottom 0.254: Q1.2 33.59,16.57 34.16,16 37.57,16 v37.67,15.91
HSU_TX/3.3V  (via drill 0.3)
  Top 0.254: U2.28 37.62,14.67 v37.59,14.71
  Bottom 0.2: Q2.2 32.13,13.34 31.62,13.84 31.62,14.86 31.37,15.11 29.8,15.11 27.56,12.88 27.56,12.37 27.19,12 26.01,12 RP2.7
  Bottom 0.254: Q2.2 34.16,14.71 v37.59,14.71
HWB
  Top 0.254: R6.1 37.85,12.74 37.85,13.6 U1.33
N$1
  Top 0.813: J3.D-1 5.76,15.11 R2.1
N$2
  Top 0.254: 25.68,14.07 Y1.1 25.74,14.07 26.54,13.27 29.36,13.27 U1.17
  Top 0.61: Y1.1 25.33,12.41 C1.1
N$4  (via drill 0.3 pad 0.41)
  Top 0.305: LED.5 18.11,18.74 20.19,20.85 v20.32,20.85
  Bottom 0.305: v20.32,20.85 22.8,20.85 23.12,20.53 23.12,19.81 23.39,19.53 RP1.3
N$5
  Top 0.254: U1.16 29.08,13.69 26.8,13.69 26.18,14.31 26.18,15.7 25.44,16.43 24.59,16.43 23.25,17.77 Y1.3
  Top 0.61: C2.1 23.03,19.14 Y1.3
N$7
  Top 0.813: J3.D+1 5.76,16.63 R3.1
N$8
  Bottom 0.406: R7.1 51.02,16.42 49.42,18.02 C13.1
N$9
  Top 0.254: U2.4 45.91,15.17 46.56,14.53 L1.2
N$10
  Top 0.254: 47.99,17.19 L2.2 47.1,16.17 U2.6
N$11
  Top 0.813: J3.VBUS1 6.31,11.55 F1.2
N$12  (via drill 0.3 pad 0.41)
  Top 0.254: v19.34,21.4 19.28,21.4 16.41,18.53 LED.6
  Bottom 0.3: v19.34,21.4 19.42,21.47 23.69,21.47
  Bottom 0.305: 23.69,21.47 24.08,21.08 RP1.4
N$13  (via drill 0.3 pad 0.41)
  Top 0.305: LED.4 19.91,17.92 v20.19,18.22
  Bottom 0.406: v20.19,18.22 20.49,17.93 RP1.1
N$47  (via drill 0.3)
  Top 0.254: v43.69,20.19 43.44,20.19 42.66,19.43 U2.14
  Bottom 0.406: Y2.1 45.33,18.4 C16.2 45.05,19.59 44.45,20.19 v43.69,20.19
N$48  (via drill 0.3)
  Top 0.254: v42.75,20.91 42.75,20.27 42.16,19.68 U2.15
  Bottom 0.2: 43.73,13.3 C17.2
  Bottom 0.305: v42.75,20.91 42.67,20.84 42.67,15.9 Y2.2
  Bottom 0.406: 43.73,13.3 Y2.2
N$49  (via drill 0.3)
  Top 0.254: U2.9 45.87,17.67 45.98,17.78 v46.41,17.78
  Bottom 0.406: C14.2 R8.2 47.72,16.61 46.55,17.78 v46.41,17.78
N$50  (via drill 0.3)
  Top 0.254: U2.10 45.61,18.17 46.03,18.59 v46.41,18.59
  Bottom 0.305: R8.1 49.42,16.5
  Bottom 0.406: v46.41,18.59 47.6,18.59 C13.2 47.72,18.48 49.42,16.78 49.42,16.5
RESET  (via drill 0.3)
  Top 0.254: U1.13 27.97,14.71 27.64,14.71 26.61,15.73 26.61,15.86 26.18,16.29 26.18,20.44 v26.6,20.86
  Top 0.406: J1.3 16.89,22.1 v21.9,22.1 | 15.5,23.37 13.68,21.55 R5.2 13.68,18.98 RST.2
  Top 0.813: 15.5,23.37 J1.3
  Bottom 0.3: 24.47,22.1 25.37,22.1 v26.6,20.86
  Bottom 0.305: v21.9,22.1 24.47,22.1
RXLED  (via drill 0.3)
  Top 0.254: U1.8 28.53,17.98 28.53,18.41 26.87,20.06 v26.8,20.06
  Bottom 0.254: RP1.5 26.06,20.33 26.33,20.06 v26.8,20.06
TX1_ANTENNA
  Top 0.813: C8.2 C9.2
  Top 1: 53.72,12.11 55.63,12.11
  Top 1.016: C9.2 53.72,12.11
TX2_ANTENNA
  Top 0.813: C11.1 | C11.1 C10.1
  Top 1: 53.8,19.73 55.63,19.73
  Top 1.016: C10.1 53.8,19.73
TXLED  (via drill 0.3)
  Top 0.254: U1.22 30.46,10.83 29.44,10.83 28.69,11.58 27.59,11.58 v27.03,11.02
  Bottom 0.2: v27.03,11.02 26.87,10.87 25.1,10.87 24.98,11 24.98,17.18 RP1.8
UCAP  (via drill 0.3)
  Top 0.254: v29.15,19.35 29.44,19.06 29.44,18.48 U1.6
  Bottom 0.2: C18.1 35.54,19.99 29.81,19.99 v29.15,19.35
VIN  (via drill 0.4)
  Top 0.305: R1.2 9.74,13.46
  Top 0.61: 9.74,13.46 v10.8,13.46
  Bottom 0.305: 9.64,13.46 9.33,13.77
  Bottom 0.61: v10.8,13.46 9.64,13.46
  Bottom 0.8: 8.76,21.84 8.76,21.65 T1.3 8.76,20.06 8.64,19.94 8.64,15.4
  Bottom 0.813: J1.1 8.76,21.84 | 8.64,15.4 8.64,14.46 9.33,13.77 T2.1 | H1.P$1 7.26,23.15 8.76,21.65
VUSB  (via drill 0.3, 0.4)
  Top 0.254: v19.88,12.32 20.45,12.32 21.43,13.29 21.43,15.4 21.34,15.49 21.34,16.06 21.72,16.44 21.72,19.85 22.95,21.08 24.7,21.08 25.11,21.49 26.81,21.49 28.5,19.77 28.5,19.09 28.98,18.6 28.98,18.23 U1.7
  Top 0.305: F1.1 15.62,11.3
  Top 0.406: 15.18,11.75 15.62,11.3 | v14.95,13.97 14.95,12 F1.1
  Top 0.55: 15.39,11.62 v17.4,11.62
  Top 0.61: F1.1 15.39,11.62 | R4.2 10.23,18.16 v10.57,17.81
  Bottom 0.2: v17.4,11.62 17.22,11.44 C24.1
  Bottom 0.254: v19.88,12.32 arc90 19.56,12.57 C21.1
  Bottom 0.305: v14.95,13.97 15.37,13.97 15.88,14.48 15.88,17.14 15.56,17.46 14.54,17.46 14.23,17.14 11.24,17.14 v10.57,17.81 10.01,18.37 T1.1
  Bottom 0.61: C21.1 19.43,12.51
  Bottom 1.016: C24.1 18.71,12.57 C21.1
XX1  (via drill 0.4)
  Top 0.61: v51.69,18.29 51.81,18.43 C10.2
  Top 0.813: C10.2 C6.1 50.02,19.14 L2.1 53.16,17.19 X1.2
  Bottom 0.61: R7.2 52.72,17.26 v51.69,18.29

### Text on the board
tPlace: VIN | GND | RST | +5V | GND | 3V3 | A5 | A4 | A3 | A2 | A1 | A0 | D11 | D12 | D13 | POWER | INPUTS | OUT | + | DIGITALS | SPI | +5V | GND | D2 | D3 | D4 | D5 | D6 | D7 | D8 | D9 | D10 | D14 | D15 | D16 | REF
bPlace: VIN | GND | RST | +5V | GND | 3V3 | A5 | A4 | A3 | A2 | A1 | A0 | D11 | D12 | D13 | KeyDuino NANO | Pierre CHARLIER | Designed by | +5V | GND | SDA | SCL | D4 | D5 | D6 | D7 | D8 | D9 | D10 | MISO | SCK | MOSI | REF
tStop: + | -
bStop: + | -